# EAGLE design Charger_18V-1.35A_СС (EAGLE 7.5.0)
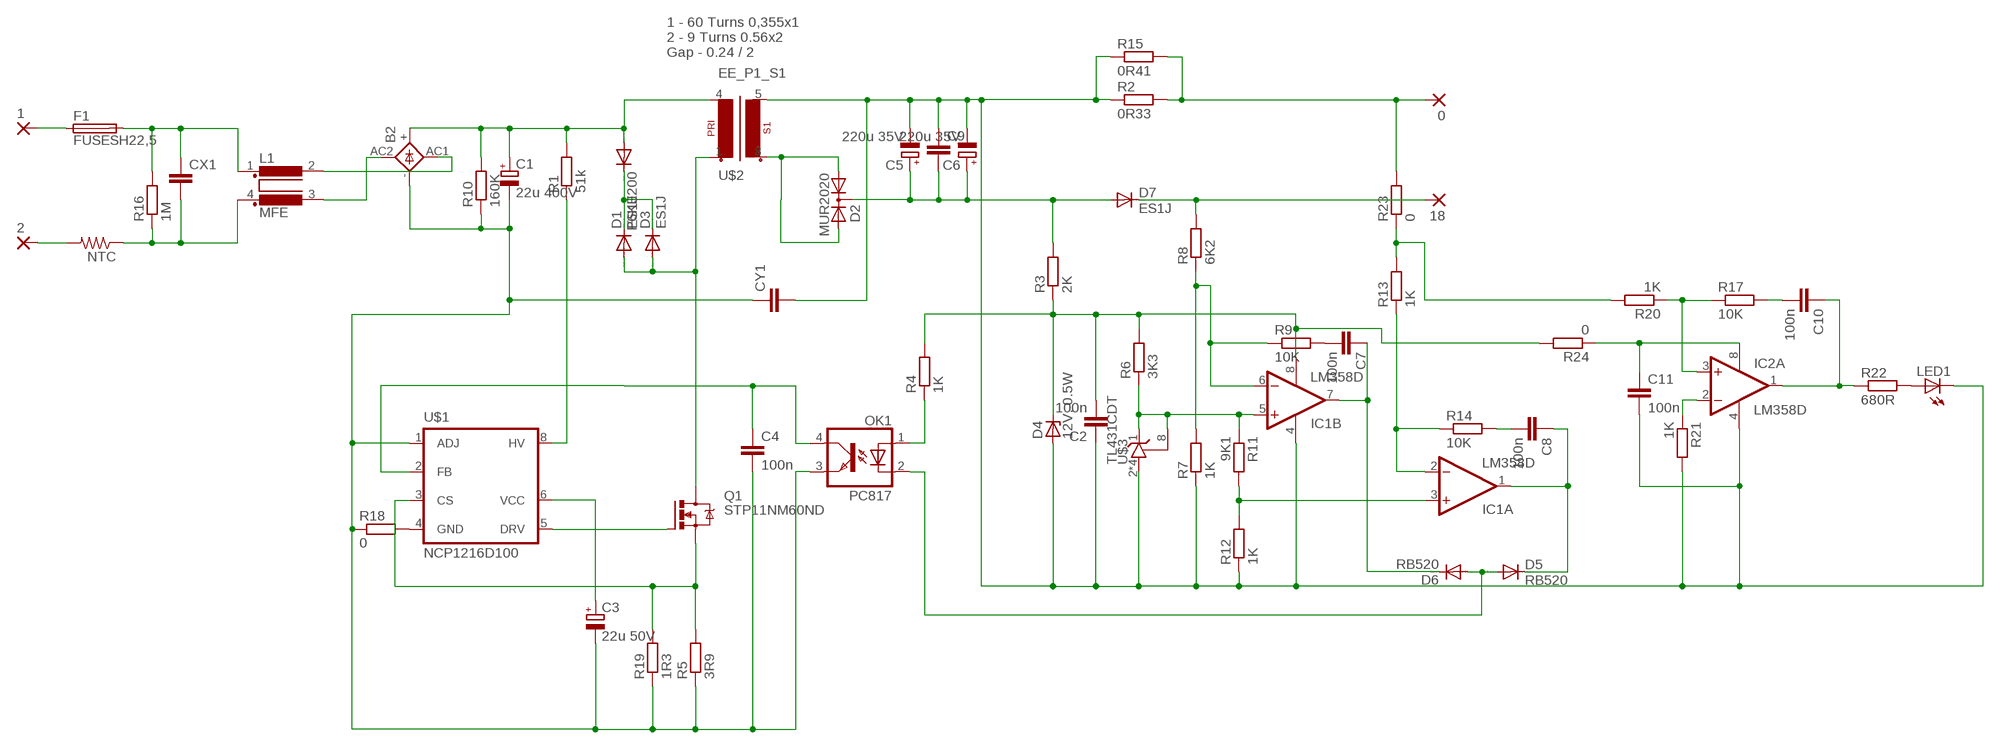
[diagram p0: schematic, sheet 1]

## Parts
0  3,81/1,4  [3,81/1,4]
1  3,81/1,4  [3,81/1,4]
2  3,81/1,4  [3,81/1,4]
18  3,81/1,4  [3,81/1,4]
B2  RS-4M  [RS-4M]
C1  22u 400V  CPOL-EUE7.5-18  [E7,5-18]
C2  100n  C-EUC0805  [C0805]
C3  22u 50V  CPOL-EUE5-5  [E5-5]
C4  100n  C-EUC0805  [C0805]
C5  220u 35V  CPOL-EUE5-10.5  [E5-10,5]
C6  220u 35V  CPOL-EUE5-10.5  [E5-10,5]
C7  100n  C-EUC0805  [C0805]
C8  100n  C-EUC0805  [C0805]
C9  C-EU050-025X075  [C050-025X075]
C10  100n  C-EUC0805  [C0805]
C11  100n  C-EUC0805  [C0805]
CX1  CXXC22B7  [XC22B7]
CY1  CYYC10B4  [YC10B4]
D1  ES1J  DIODE-DO-214AC  [DO-214AC]
D2  MUR2020  DIODE-2AC|CATO220V  [TO220ABS]
D3  ES1J  DIODE-DO-214AC  [DO-214AC]
D4  12V, 0.5W  ZENER-DIODESOD80C  [SOD80C]
D5  RB520  DIODE-SOD523  [SOD523]
D6  RB520  DIODE-SOD523  [SOD523]
D7  ES1J  DIODE-DO-214AC  [DO-214AC]
F1  FUSESH22,5  [SH22,5]
IC1  LM358D  [SO08]
IC2  LM358D  [SO08]
L1  MFE  [MFE]
LED1  LED5MM  [LED5MM]
NTC  R-US_0207/7  [0207/7]
OK1  PC817  [DIL04]
P6KE200  DIODE-SMB  [SMB]
Q1  STP11NM60ND  IRF740  [TO220BV]
R1  51k  R_SQP-5  [SQP-5]
R2  0R33  R-EU_0411/15  [0411/15]
R3  2K  R-EU_R1206  [R1206]
R4  1K  R-EU_R0603  [R0603]
R5  3R9  R-EU_0309/12  [0309/12]
R6  3K3  R-EU_R1206  [R1206]
R7  1K  R-EU_R0603  [R0603]
R8  6K2  R-EU_R0805  [R0805]
R9  10K  R-EU_R0805  [R0805]
R10  160K  R-EU_0204/7  [0204/7]
R11  9K1  R-EU_R1206  [R1206]
R12  1K  R-EU_R0603  [R0603]
R13  1K  R-EU_R0603  [R0603]
R14  10K  R-EU_R0805  [R0805]
R15  0R41  R-EU_0411/15  [0411/15]
R16  1M  R-EU_0207/12  [0207/12]
R17  10K  R-EU_R0805  [R0805]
R18  0  R-EU_R1206  [R1206]
R19  1R3  R-EU_0309/12  [0309/12]
R20  1K  R-EU_R0603  [R0603]
R21  1K  R-EU_R0603  [R0603]
R22  680R  R-EU_R0805  [R0805]
R23  0  R-EU_R1206  [R1206]
R24  0  R-EU_R1206  [R1206]
U$1  NCP1216D100  NCP1200-100SO  [SOP8]
U$2  EE_P1_S1  [EE25_P1_S1]
U$3  TL431CDT  [SO8]

## Nets
N$1: 2.1(P) NTC.2
N$2: CX1.1 F1.2 L1.1 R16.2
N$3: B2.AC2(AC1) L1.3
N$4: D2.A1 D2.A2 U$2.8(S1-1)
N$5: C4.1 OK1.4(COL) U$1.2(FB)
N$6: B2.+ C1.+ P6KE200.A R1.2 R10.2 U$2.4(P1-2)
N$7: D1.C D3.C P6KE200.C
N$8: D1.A D3.A Q1.D U$2.1(P1-1)
N$9: 0.1(P) R2.2 R15.2 R23.2
N$10: R1.1 U$1.8(HV)
N$11: Q1.G U$1.5(DRV)
N$12: Q1.S R5.2 R19.2 U$1.3(CS)
N$13: C2.2 D4.C IC1.8(P:V+) R3.1 R4.2 R6.2 R24.2
N$14: C3.+ U$1.6(VCC)
N$15: OK1.1(A) R4.1
N$16: B2.- C1.- C3.- C4.2 CY1.1 OK1.3(EMIT) R5.1 R10.1 R18.1 R19.1 U$1.1(ADJ)
N$17: IC1.3(A:+IN) R11.2 R12.2
N$18: C2.1 C5.- C6.- C9.1 C11.2 CY1.2 D4.A IC1.4(P:V-) IC2.4(P:V-) LED1.K(C) R2.1 R7.1 R12.1 R15.1 R21.2 U$2.5(S1-2) U$3.2(A) U$3.3(A) U$3.6(A) U$3.7(A)
N$19: C5.+ C6.+ C9.2 D2.C D7.A R3.2
N$20: IC1.5(B:+IN) R6.1 R11.1 U$3.1(C) U$3.8(R)
N$21: IC1.6(B:-IN) R7.2 R8.1 R9.1
N$23: C7.2 R9.2
N$24: C7.1 D6.C IC1.7(B:OUT)
N$25: IC1.2(A:-IN) R13.1 R14.1
N$26: C8.2 R14.2
N$27: C8.1 D5.C IC1.1(A:OUT)
N$28: D5.A D6.A OK1.2(C)
N$29: C10.1 IC2.1(A:OUT) R22.1
N$31: R18.2 U$1.4(GND)
N$33: B2.AC1(AC2) L1.2
N$34: CX1.2 L1.4 NTC.1 R16.1
N$36: 1.1(P) F1.1
N$37: C10.2 R17.2
N$38: IC2.3(A:+IN) R17.1 R20.1
N$39: IC2.2(A:-IN) R21.1
N$40: C11.1 IC2.8(P:V+) R24.1
N$41: 18.1(P) D7.C R8.2
N$42: LED1.A R22.2
N$43: R13.2 R20.2 R23.1
Unconnected: IC2.5(B:+IN) IC2.6(B:-IN) IC2.7(B:OUT)

## Notes on the sheet
- 1 - 60 Turns 0,355x1
  2 - 9 Turns 0.56x2
  Gap - 0.24 / 2

## Library data of the parts
0 1 2 18 = wirepad:3,81/1,4: THROUGH-HOLE PAD
B2 = Namenlos:RS-4M: GENERAL INSTRUMENT RECTIFIER
C1 C3 C5 C6 = rcl:CPOL-EU: POLARIZED CAPACITOR, European symbol
C2 C4 C7-C11 = rcl:C-EU: CAPACITOR, European symbol
CX1 = rcl:CX: X CAPACITOR for power line
CY1 = rcl:CY: Y CAPACITOR for power line
D1 D3 D5-D7 P6KE200 = diode:DIODE-: DIODE
D2 = diode:DIODE-2AC|CA: Dual DIODE Anode-Cathode|Cathode-Anode
D4 = diode:ZENER-DIODE: Z-Diode
F1 = fuse:FUSE: Fuse; OC_FARNELL: unknown; OC_NEWARK: unknown
IC1 IC2 = linear:LM358: OP AMP also LM158; LM258; LM2904 Source: http://cache.national.com/ds/LM/LM158.pdf
L1 = inductors:MFE: FILTER
LED1 = led:LED: LED OSRAM: - CHIPLED LG R971, LG N971, LY N971, LG Q971, LY Q971, LO R971, LY R971 LH N974, LH R974 LS Q976, LO Q976, LY Q976 LO Q996 - Hyper CHIPLED LW Q18S LB Q993, LB Q99A, LB R99A - SideLED LS A670, LO A670, LY A670, LG A670, LP A670 LB A673, LV A673, LT A673, LW A673 LH A674 LY A675 LS A676, LA A676, LO A676, LY A676, LW A676 LS A679, LY A679, LG A679 - Hyper Micro SIDELED® LS Y876, LA Y876, LO Y876, LY Y876 LT Y87S - SmartLED LW L88C, LW L88S LB L89C, LB L89S, LG L890 LS L89K, LO L89K, LY L89K LS L896, LA L896, LO L896, LY L896 - TOPLED LS T670, LO T670, LY T670, LG T670, LP T670 LSG T670, LSP T670, LSY T670, LOP T670, LYG T670 LG T671, LOG T671, LSG T671 LB T673, LV T673, LT T673, LW T673 LH T674 LS T676, LA T676, LO T676, LY T676, LB T676, LH T676, LSB T676, LW T676 LB T67C, LV T67C, LT T67C, LS T67K, LO T67K, LY T67K, LW E67C LS E67B, LA E67B, LO E67B, LY E67B, LB E67C, LV E67C, LT E67C LW T67C LS T679, LY T679, LG T679 LS T770, LO T770, LY T770, LG T770, LP T770 LB T773, LV T773, LT T773, LW T773 LH T774 LS E675, LA E675, LY E675, LS T675 LS T776, LA T776, LO T776, LY T776, LB T776 LHGB T686 LT T68C, LB T68C - Hyper Mini TOPLED® LB M676 - Mini TOPLED Santana® LG M470 LS M47K, LO M47K, LY M47K Source: http://www.osram.convergy.de LUXEON: - LUMILED® LXK2-PW12-R00, LXK2-PW12-S00, LXK2-PW14-U00, LXK2-PW14-V00 LXK2-PM12-R00, LXK2-PM12-S00, LXK2-PM14-U00 LXK2-PE12-Q00, LXK2-PE12-R00, LXK2-PE12-S00, LXK2-PE14-T00, LXK2-PE14-U00 LXK2-PB12-K00, LXK2-PB12-L00, LXK2-PB12-M00, LXK2-PB14-N00, LXK2-PB14-P00, LXK2-PB14-Q00 LXK2-PR12-L00, LXK2-PR12-M00, LXK2-PR14-Q00, LXK2-PR14-R00 LXK2-PD12-Q00, LXK2-PD12-R00, LXK2-PD12-S00 LXK2-PH12-R00, LXK2-PH12-S00 LXK2-PL12-P00, LXK2-PL12-Q00, LXK2-PL12-R00 Source: www.luxeon.com KINGBRIGHT: KA-3528ASYC Source: www.kingbright.com
NTC = rcl:R-US_: RESISTOR, American symbol
OK1 = optocoupler:PC817: SHARP OPTO COUPLER; MPN: PC817X4J000F; OC_FARNELL: 9707727; OC_NEWARK: 97K7059
Q1 = transistor-power:IRF740: N-CHANNEL MOS FET
R1 = Namenlos:R_SQP-5
R2-R24 = rcl:R-EU_: RESISTOR, European symbol
U$1 = NCP1200:NCP1200-100
U$2 = _Transformers:EE_P1_S1
U$3 = Namenlos:TL431

## Board
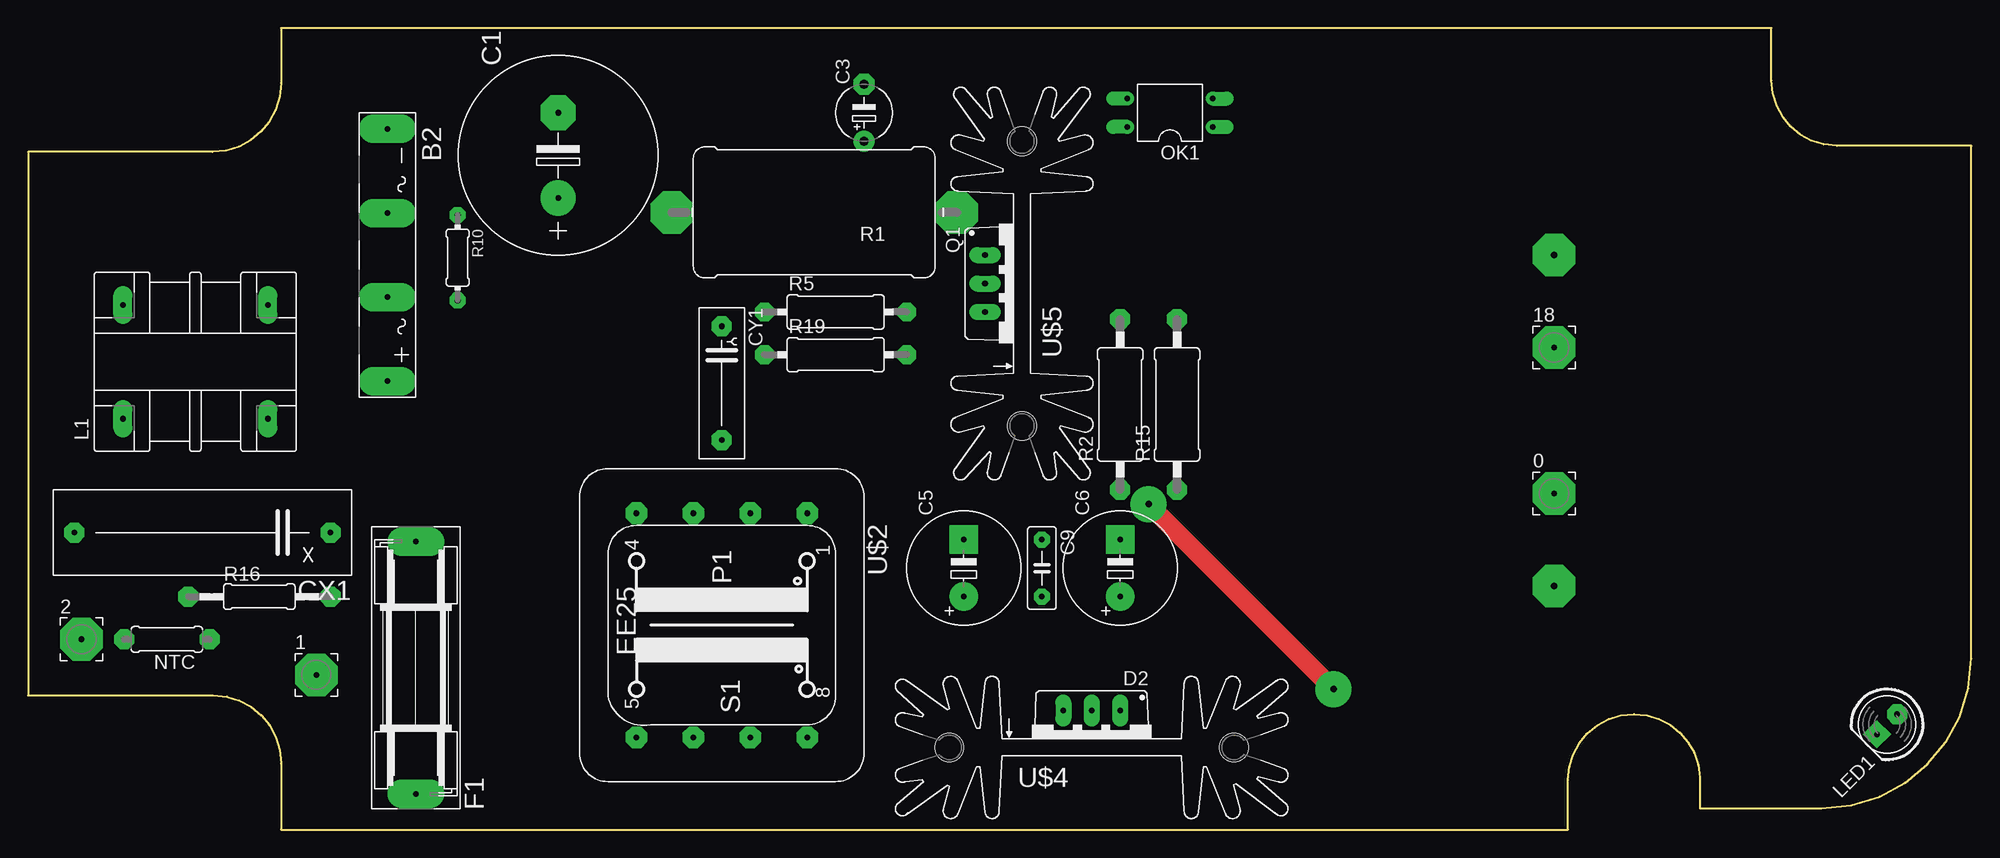
[diagram p1: board, top side]
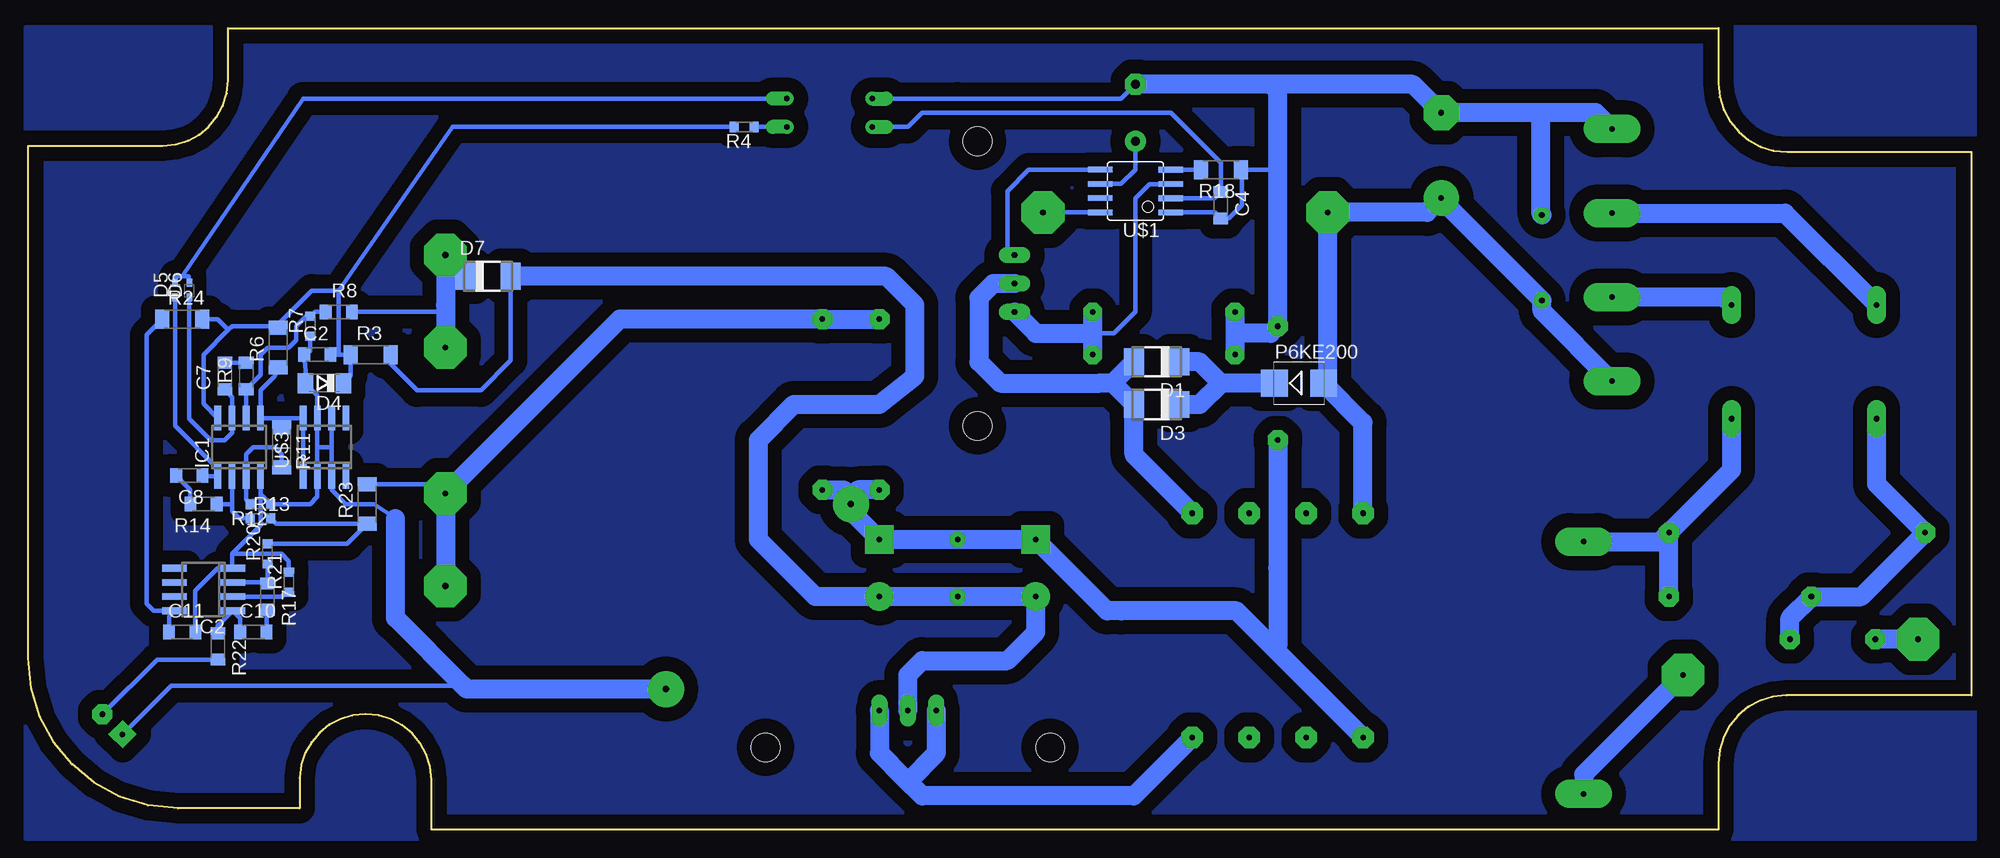
[diagram p2: board, bottom side, seen from below]

Size 173.48 x 71.54 mm. Coordinates in mm from the lower left corner, seen from the top.
Outline: 155.62,71.54 22.6,71.54 22.6,66.63 22.47,65.39 22.11,64.24 21.54,63.2 20.79,62.29 19.88,61.54 18.84,60.97 17.68,60.61 16.45,60.48 0,60.48 0,12 16.53,12 17.75,11.87 18.89,11.52 19.92,10.96 20.81,10.21 21.56,9.32 22.12,8.29 22.47,7.15 22.6,5.93 22.6,0 137.47,0 137.47,4.43 137.59,5.62 137.93,6.72 138.48,7.72 139.2,8.59 140.07,9.31 141.07,9.86 142.17,10.2 143.36,10.32 144.52,10.21 145.6,9.87 146.58,9.35 147.45,8.66 148.17,7.82 148.72,6.85 149.09,5.78 149.24,4.63 149.24,4.63 149.24,1.9 160.08,1.9 162.77,2.17 165.29,2.96 167.56,4.2 169.55,5.84 171.19,7.82 172.42,10.1 173.21,12.61 173.48,15.3 173.48,61.03 161.46,61.03 160.29,61.15 159.19,61.49 158.2,62.03 157.34,62.75 156.62,63.61 156.08,64.61 155.74,65.7 155.62,66.87 155.62,71.54
Copper layers (1*16): Top 0.035mm / dielectric 1.5mm / Bottom 0.035mm
Design rules "default": minimum track width 10mil, minimum drill 24mil, track to track 8mil, track to pad 8mil, pad to pad 8mil, via to via 8mil, smd to smd 8mil, copper to edge 40mil, drill to drill 8mil, minimum pad ring 10mil, minimum via ring 8mil, stop-mask expansion 4mil, vias tented up to drill 0mil, thermal gap 10mil

### Footprints (pad centres in the part's own frame; a part is rotated, then mirrored left to right if it is on the bottom)
3,81/1,4 = drill 0.5 pad 3.81 octagon: 1 0,0
RS-4M = drill 0.5 pad 2.54 long: + 11.25,0; - -11.25,0; AC1 3.75,0; AC2 -3.75,0
E7,5-18 = drill 0.5 pad 3.15: + -3.81,0 | drill 0.5 pad 3.15 octagon: - 3.81,0
C0805 = smd 1.05 x 1.3: 1 -1.175,0; 2 1.175,0
E5-5 = drill 0.813 pad 1.905: + -2.54,0 | drill 0.813 pad 1.905 octagon: - 2.54,0
E5-10,5 = drill 0.5 pad 2.54: + -2.54,0 | drill 0.5 pad 2.54 square: - 2.54,0
C050-025X075 = drill 0.5 pad 1.422 octagon: 1 -2.54,0; 2 2.54,0
XC22B7 = drill 0.5 pad 1.778 octagon: 1 -11.43,0; 2 11.43,0
YC10B4 = drill 0.5 pad 1.778 octagon: 1 -5.08,0; 2 5.08,0
DO-214AC = smd 1.8 x 2.4: A 2.025,0; C -2.025,0
TO220ABS = drill 0.5 pad 1.422 long: A1 -2.54,-2.54; A2 2.54,-2.54; C 0,-2.54
SOD80C = smd 1.4 x 1.8: A 1.7,0; C -1.7,0
SOD523 = smd 0.7 x 0.5: A 0.7,0; C -0.6,0
SH22,5 = drill 0.5 pad 2.54 long: 1 -11.252,0; 2 11.252,0
SO08 = smd 0.6 x 2.2: 1 -1.905,-2.6; 2 -0.635,-2.6; 3 0.635,-2.6; 4 1.905,-2.6; 5 1.905,2.6; 6 0.635,2.6; 7 -0.635,2.6; 8 -1.905,2.6
MFE = drill 0.5 pad 1.676 long: 1 6.477,-5.08; 2 6.477,5.08; 3 -6.477,5.08; 4 -6.477,-5.08
LED5MM = drill 0.5 pad 1.778 octagon: A -1.27,0 | drill 0.5 pad 1.778 square: K 1.27,0
0207/7 = drill 0.5 pad 1.778 octagon: 1 -3.81,0; 2 3.81,0
DIL04 = drill 0.5 pad 1.27 offset: 1 -1.27,-3.81; 2 1.27,-3.81; 3 1.27,3.81; 4 -1.27,3.81
SMB = smd 2.4 x 2.4: A 2.2,0; C -2.2,0
TO220BV = drill 0.5 pad 1.422 long: D 0,-2.54; G -2.54,-2.54; S 2.54,-2.54
SQP-5 = drill 0.5 pad 3.81 octagon: 1 -12.7,0; 2 12.7,0
0411/15 = drill 0.5 pad 1.778 octagon: 1 -7.62,0; 2 7.62,0
R1206 = smd 1.25 x 1.7: 1 -1.775,0; 2 1.775,0
R0603 = smd 0.8 x 0.9: 1 -0.9,0; 2 0.9,0
0309/12 = drill 0.5 pad 1.676 octagon: 1 -6.35,0; 2 6.35,0
R0805 = smd 1.05 x 1.3: 1 -1.175,0; 2 1.175,0
0204/7 = drill 0.5 pad 1.422 octagon: 1 -3.81,0; 2 3.81,0
0207/12 = drill 0.5 pad 1.778 octagon: 1 -6.35,0; 2 6.35,0
SOP8 = smd 0.5 x 2.2: 1 -1.905,-3.154; 2 -0.645,-3.154; 3 0.625,-3.154; 4 1.895,-3.154; 5 1.905,3.154; 6 0.635,3.154; 7 -0.635,3.154; 8 -1.905,3.154
EE25_P1_S1 = drill 0.5 pad 1.93 octagon: 1 -9.98,7.62; 2 -9.98,2.54; 3 -9.98,-2.54; 4 -9.98,-7.62; 5 10.02,-7.62; 6 10.02,-2.54; 7 10.02,2.54; 8 10.02,7.62
SO8 = smd 0.6 x 2.2: 1 -1.905,-2.6; 2 -0.635,-2.6; 3 0.635,-2.6; 4 1.905,-2.6; 5 1.905,2.6; 6 0.635,2.6; 7 -0.635,2.6; 8 -1.905,2.6
SK104 = hole 2.54: -12.7,-0.762; 12.7,-0.762

### Placement (x,y rotation side)
0  136.22,30.01 0 top
1  25.73,13.82 0 top
2  4.78,16.99 0 top
18  136.22,43.03 0 top
B2  32.08,51.28 270 top
C1  47.32,60.17 90 top
C2  147.65,42.39 0 bottom
C3  74.63,63.98 90 top
C4  67.01,55.73 270 bottom
C5  83.52,23.34 90 top
C6  97.49,23.34 90 top
C7  155.91,40.49 90 bottom
C8  159.08,31.6 180 bottom
C9  90.5,23.34 270 top
C10  153.37,17.63 0 bottom
C11  159.72,17.63 0 bottom
CX1  15.57,26.52 180 top
CY1  61.93,39.85 270 top
D1  72.72,41.76 180 bottom
D2  94.95,8.1 180 top
D3  72.72,37.95 180 bottom
D4  147.02,39.85 180 bottom
D5  160.35,48.11 90 bottom
D6  159.08,48.11 90 bottom
D7  132.41,49.38 0 bottom
F1  34.62,14.45 90 top
IC1  154.64,34.14 0 bottom
IC2  157.81,21.44 90 bottom
L1  14.94,41.76 0 top
LED1  165.95,9.4 225 top
NTC  12.4,16.99 180 top
OK1  101.93,63.98 90 top
P6KE200  60.02,39.85 0 bottom
Q1  87.96,48.74 270 top
R1  70.18,55.09 180 top
R2  97.49,37.95 90 top
R3  142.89,42.39 0 bottom
R4  109.55,62.71 180 bottom
R5  72.09,46.2 0 top
R6  151.15,43.03 90 bottom
R7  148.29,44.93 90 bottom
R8  145.75,46.2 0 bottom
R9  154,40.49 90 bottom
R10  38.35,51.05 270 top
R11  150.83,34.14 270 bottom
R12  152.73,29.06 180 bottom
R13  152.73,27.79 0 bottom
R14  157.81,29.06 180 bottom
R15  102.57,37.95 90 top
R16  20.65,20.8 0 top
R17  152.1,20.8 270 bottom
R18  67.01,58.9 180 bottom
R19  72.09,42.39 0 top
R20  152.1,24.61 90 bottom
R21  150.19,22.07 90 bottom
R22  156.54,16.36 270 bottom
R23  143.21,29.06 90 bottom
R24  159.72,45.57 0 bottom
U$1  74.63,57 90 bottom
U$2  61.93,18.26 270 top
U$3  147.02,34.14 0 bottom
U$4  [SK104]  94.95,8.1 0 top
U$5  [SK104]  87.96,48.74 90 top

### Tracks (layer width: path | path; a pad name or v marks a point on that pad's centre or on a via)
N$1
  Bottom 1.676: 2.1 NTC.2
N$2
  Bottom 1.676: R16.2 CX1.1 | F1.2 27.82,25.7 CX1.1 | CX1.1 21.42,32.1 L1.1
N$3
  Bottom 1.676: B2.AC2 16.66,55.03 L1.3
N$4
  Bottom 1.676: U$2.8 74.77,3.02 93.68,3.02 95.27,4.61 | D2.A2 92.41,6.83 94.95,4.29 95.27,4.61 | D2.A1 97.49,6.83 95.27,4.61
N$5
  Bottom 0.406: U$1.2 67.56,56.35 C4.1 67.01,59.54 71.45,63.98 89.87,63.98 93.68,63.98 94.95,62.71 OK1.4
N$6
  Bottom 1.27: 57.48,40.49 57.48,40.19 P6KE200.A
  Bottom 1.676: 57.48,40.49 R1.2 48.59,55.09 C1.+ 47.32,56.21 R10.2 38.35,46.3 B2.+ | U$2.4 54.31,36.34 P6KE200.A
N$7
  Bottom 1.676: P6KE200.C 67.01,39.85 | 67.01,39.85 68.91,41.76 D1.C | D3.C 68.91,37.95 67.01,39.85
N$8
  Bottom 1.27: 76.65,39.85 76.59,39.91 75.9,39.22
  Bottom 1.676: Q1.D 87.33,48.74 88.6,47.47 88.6,41.76 86.69,39.85 77.8,39.85 76.65,39.85 D3.A 74.75,33.44 U$2.1 | D1.A 76.59,39.91
N$9
  Bottom 0.406: R23.2 137.05,30.83 0.1
  Bottom 1.676: R2.2 R15.2 120.67,45.57 0.1
N$10
  Bottom 0.406: U$1.8 R1.1
N$11
  Bottom 0.406: U$1.5 84.15,58.9 86.06,57 86.06,51.92 Q1.G
N$12
  Bottom 0.406: U$1.3 73.37,57.62 74.63,56.36 74.63,46.2 76.53,44.3 78.44,44.3
  Bottom 1.676: R19.2 78.44,44.3 | 78.44,44.3 R5.2 | Q1.S 83.52,44.3 78.44,44.3
N$13
  Bottom 0.406: 144.95,40.22 D4.C | C2.2 145.75,42.39 | 145.75,42.39 R3.1 144.67,40.5 144.95,40.22 | 145.75,48.11 145.75,47.47 145.75,44.93 145.75,44.3 145.75,42.39 | 145.75,48.11 148.16,48.11 151.15,45.12 R6.2 151.59,44.93 155.27,44.93 155.59,44.61 | IC1.8 157.81,38.01 157.81,42.39 155.59,44.61 | 144.95,40.22 145.3,40.58 | R4.2 135.59,62.71 145.75,48.11 | R24.2 156.54,45.57 155.59,44.61
N$14
  Bottom 0.406: C3.+ 74.63,58.9 75.9,57.63 U$1.6
N$15
  Bottom 0.406: OK1.1 R4.1
N$16
  Bottom 0.406: C3.- 75.9,65.25 90.5,65.25 OK1.3 | U$1.1 67.55,55.09 C4.2 66.28,54.55 65.1,55.73 65.1,58.77 R18.1 61.93,58.9
  Bottom 1.676: B2.- 33.53,63.98 38.43,63.98 | 38.43,63.98 C1.- 49.86,66.52 62.56,66.52 | R10.1 38.43,54.94 38.43,63.98 | 62.56,66.52 C3.- | 65.74,44.3 62.56,44.3 CY1.1 61.93,58.9 61.93,65.89 62.56,66.52 | 65.74,44.3 R19.1 | R5.1 65.74,44.3
N$17
  Bottom 0.406: R12.2 154,29.43 IC1.3 154,33.5 153.37,34.14 151.46,34.14 150.83,33.5 R11.2
N$18  (via drill 0.6 pad 3.2)
  Top 1.676: v100.03,29.06 v116.54,12.55
  Bottom 0.406: U$3.6 146.38,34.14 | 146.38,34.14 U$3.3 146.38,30.33 145.11,29.06 142.57,29.06 140.67,27.79 | 147.65,34.14 U$3.2 147.65,29.69 148.29,29.06 R12.1 152.73,29.96 | 147.65,34.14 U$3.7 | U$3.7 147.65,34.14 | 147.65,34.14 146.38,34.14 | R7.1 148.29,42.71 C2.1 148.6,39.97 D4.A 147.65,38.79 U$3.7 | IC1.4 152.73,30.33 152.73,29.96 | 152.73,29.96 152.73,27.15 155.27,24.61 | 155.27,24.61 155.27,23.4 IC2.4 156.54,23.34 157.5,22.39 | R21.2 150.19,23.98 150.83,24.61 155.27,24.61 | 157.91,21.98 157.5,22.39 | C11.2 158.54,21.34 157.5,22.39 | LED1.K 160.69,12.86 134.64,12.86
  Bottom 1.676: U$2.5 62.18,16.11 | 62.18,16.11 65.6,19.53 75.9,19.53 77.17,19.53 C5.- C9.1 C6.- 100.03,28.42 v100.03,29.06 100.03,29.69 | CY1.2 61.93,23.34 61.93,16.36 62.18,16.11 | R2.1 99.39,30.33 100.03,29.69 | R15.1 100.66,30.33 100.03,29.69 | v116.54,12.55 134.32,12.55 134.64,12.86 140.67,18.9 140.67,27.79
N$19
  Bottom 0.406: R3.2 140.67,42.39 | 141.3,42.58 R3.2 | R3.2 141.3,42.2 141.3,41.76 138.76,39.22 133.05,39.22 130.39,41.88 D7.A 129.87,49.38
  Bottom 1.676: D2.C 94.95,13.82 93.68,15.09 86.06,15.09 83.52,17.63 83.52,20.17 C5.+ C9.2 C6.+ 103.2,20.8 108.28,25.88 108.28,34.77 105.11,37.95 97.49,37.95 94.31,40.49 94.31,46.84 96.85,49.38 129.87,49.38
N$20
  Bottom 0.406: U$3.1 U$3.8 150.83,36.74 | 150.83,36.74 IC1.5 152.73,39.22 151.46,40.49 R6.1 | R11.1 150.83,36.74
N$21
  Bottom 0.406: R8.1 147.87,46.2 R7.2 148.66,45.83 148.92,45.57 149.56,44.93 149.56,43.66 150.19,43.03 152.1,43.03 152.73,42.39 152.73,40.58 R9.1 154,39.22 IC1.6
N$22
  pour Bottom (isolate 1.27): -0.3,-0.79 -0.3,71.6 155.91,71.6 173.69,71.6 173.69,18.26 173.69,-0.79
N$23
  Bottom 0.406: C7.2 155.81,41.53 155.68,41.66 R9.2
N$24
  Bottom 0.406: C7.1 155.91,39.22 155.27,38.58 IC1.7 155.27,35.41 155.91,34.77 157.18,34.77 159.08,36.68 D6.C
N$25
  Bottom 0.406: 155.27,29.06 155.27,28.42 154.64,27.79 R13.1 | 155.27,29.06 IC1.2 | R14.1 155.27,29.06
N$26
  Bottom 0.406: R14.2 158.99,30.33 C8.2
N$27
  Bottom 0.406: C8.1 157.55,31.54 IC1.1 156.54,32.23 160.35,36.04 D5.C
N$28
  Bottom 0.406: D6.A 159.15,49.38 159.72,49.38 | D5.A 160.29,49.38 159.72,49.38 | 159.72,49.38 148.92,65.25 148.29,65.25 OK1.2
N$29
  Bottom 0.406: C10.1 154.54,18.86 IC2.1 156.54,18.2 R22.1
N$30
  Bottom 1.676: 136.22,29.69 136.22,21.44
N$31
  Bottom 0.406: R18.2 71.46,58.9 U$1.4
N$32  (via drill 0.6 pad 3.81)
  other vias: 136.22,51.28
N$33
  Bottom 1.676: L1.2 22.11,47.53 B2.AC1
N$34
  Bottom 1.676: NTC.1 16.21,18.9 R16.1 9.86,20.8 CX1.2 8.46,30.83 L1.4
N$35  (via drill 0.6 pad 3.81)
  other vias: 136.22,21.75
N$36
  Bottom 1.676: 1.1 34.62,4.93 F1.1
N$37
  Bottom 0.406: C10.2 152.19,19.53 R17.2
N$38
  Bottom 0.406: R20.1 R17.1 152.19,22.07 IC2.3
N$39
  Bottom 0.406: R21.1 150.46,21.17 150.83,20.8 IC2.2
N$40
  Bottom 0.406: R24.1 162.89,44.17 162.89,20.17 162.26,19.53 IC2.8 160.89,19.05 C11.1
N$41
  Bottom 0.406: R8.2 136.86,46.2 136.22,46.84
  Bottom 1.676: 136.22,51.92 136.22,50.01 | 136.22,50.01 136.22,46.84 18.1 | D7.C 135.59,49.38 136.22,50.01
N$42
  Bottom 0.406: LED1.A 161.96,15.18 R22.2
N$43
  Bottom 0.406: R13.2 151.33,27.28 R23.1 144.98,25.51 R20.2